# Altium project Arduino_Space.PrjPcb
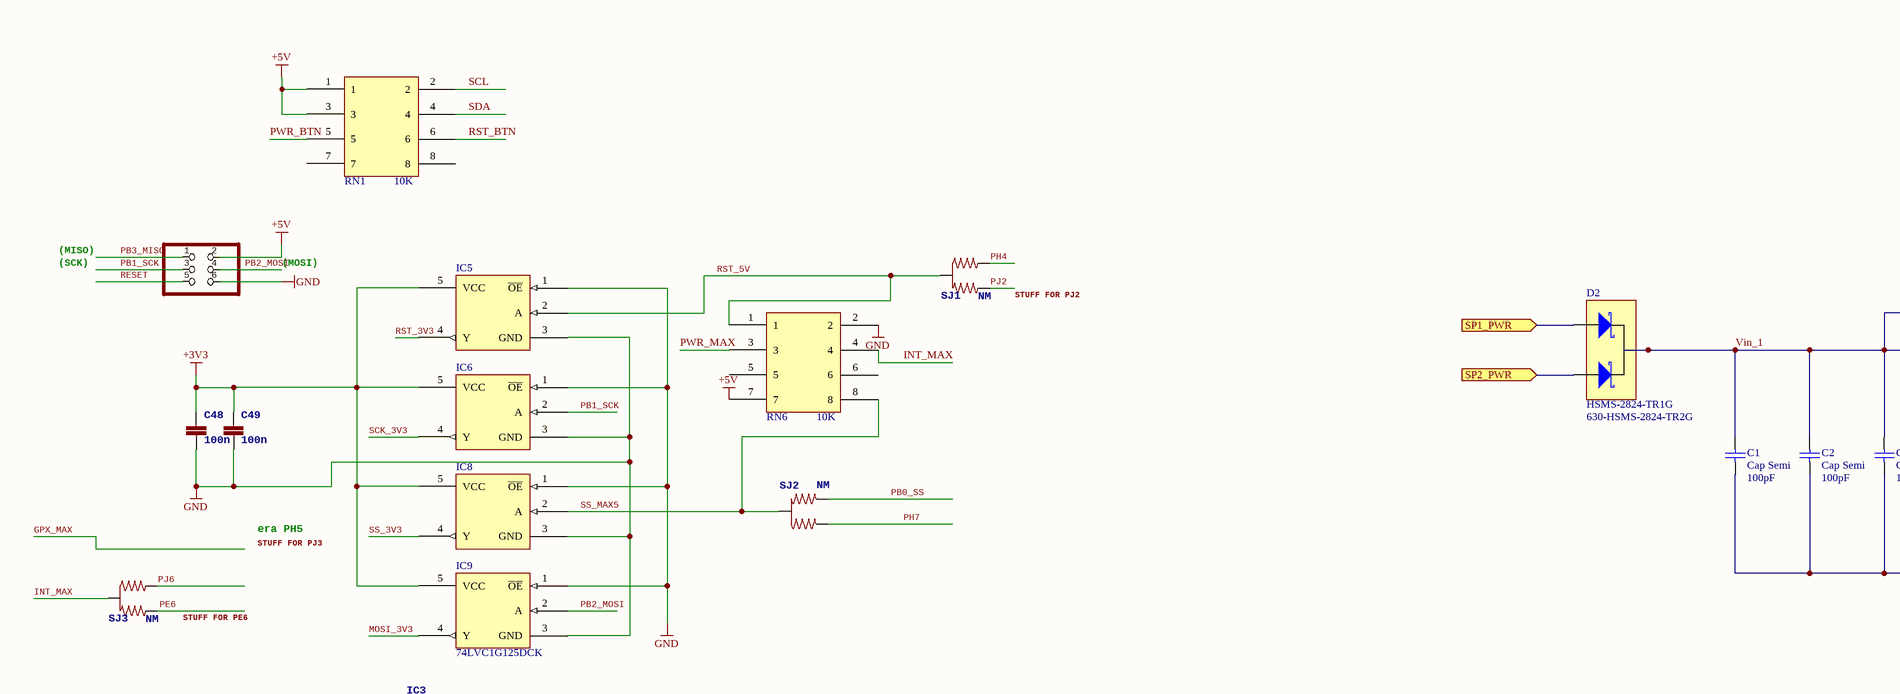
[diagram p0: UPCNSL-ABS-FLS-ARD.SchDoc, top left]
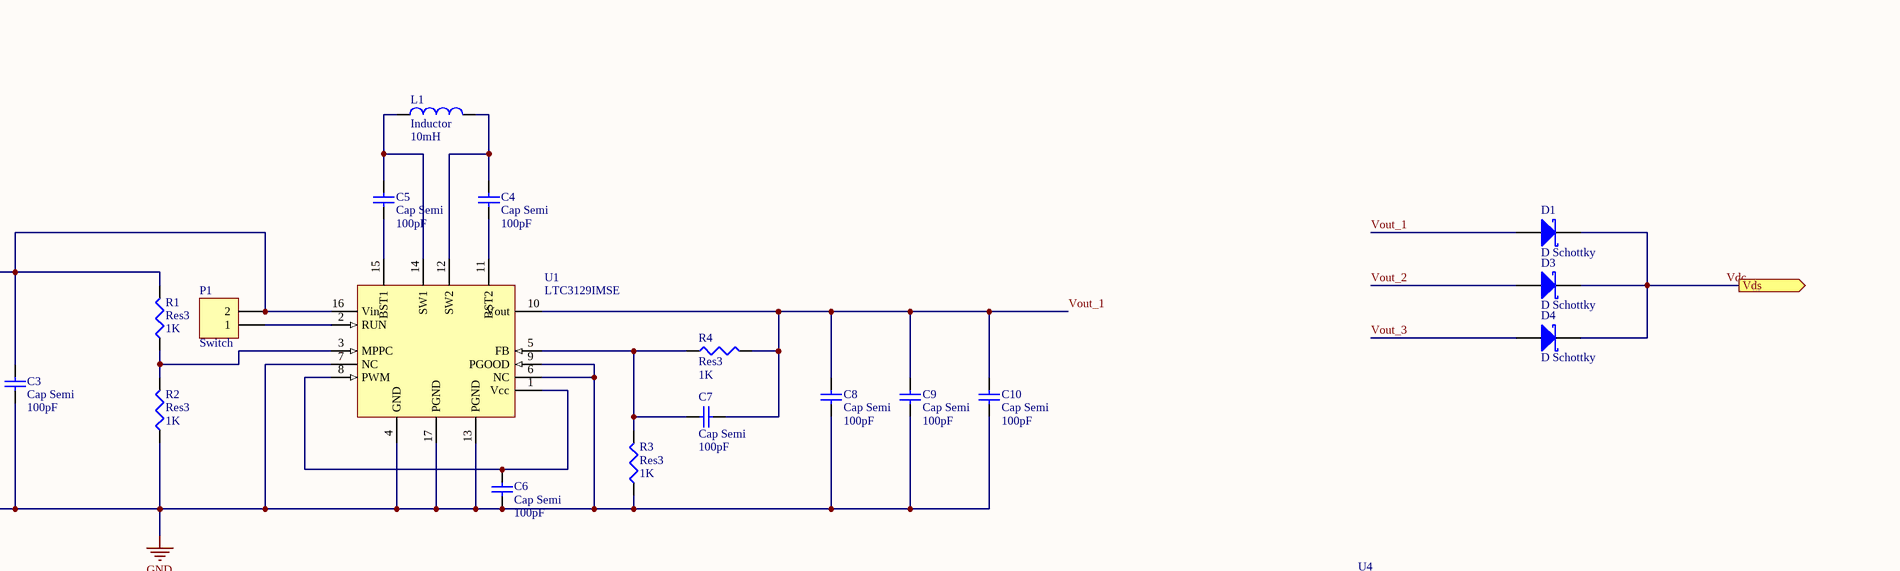
[diagram p1: UPCNSL-ABS-FLS-ARD.SchDoc, top right]
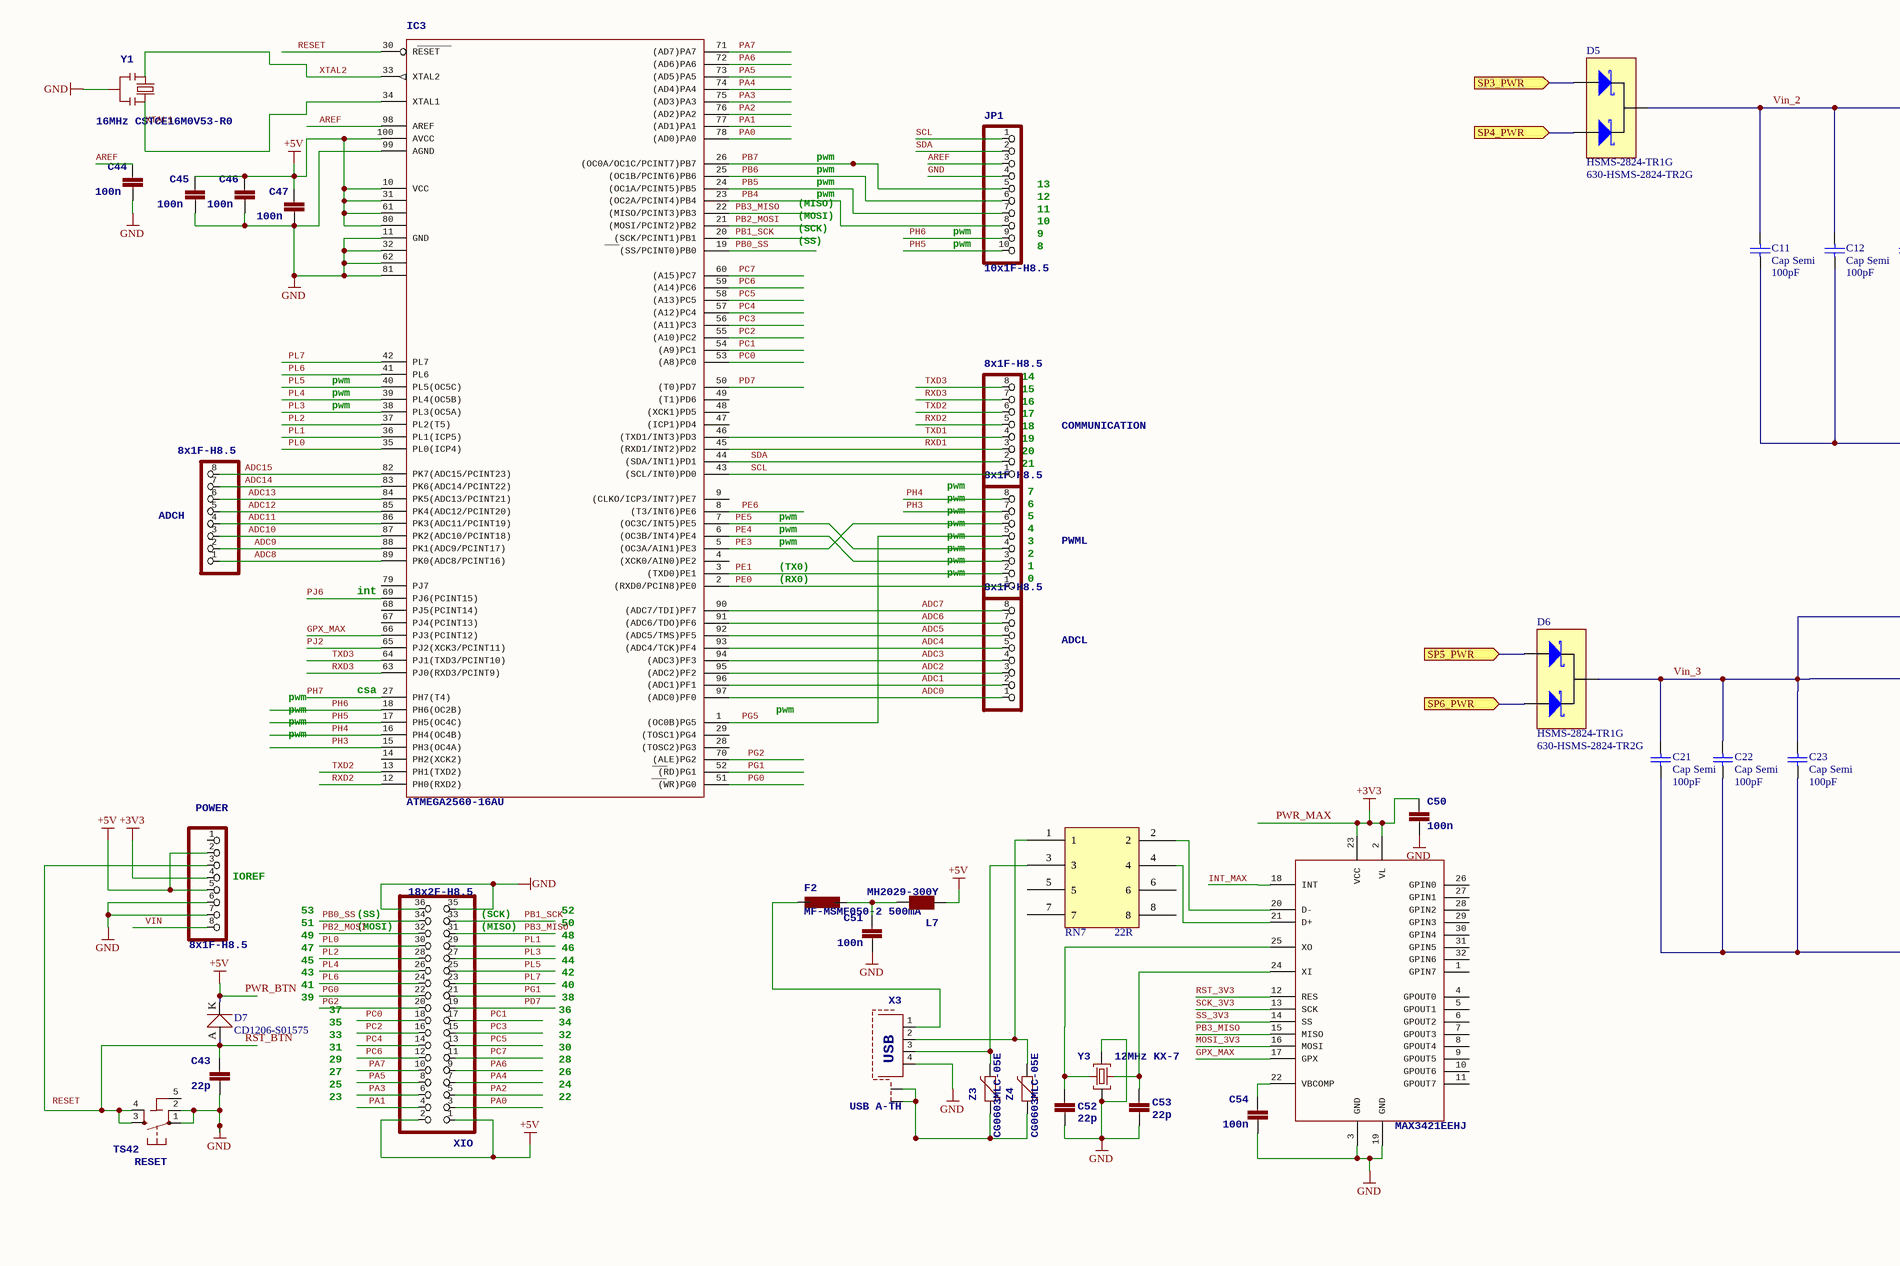
[diagram p2: UPCNSL-ABS-FLS-ARD.SchDoc, bottom left]
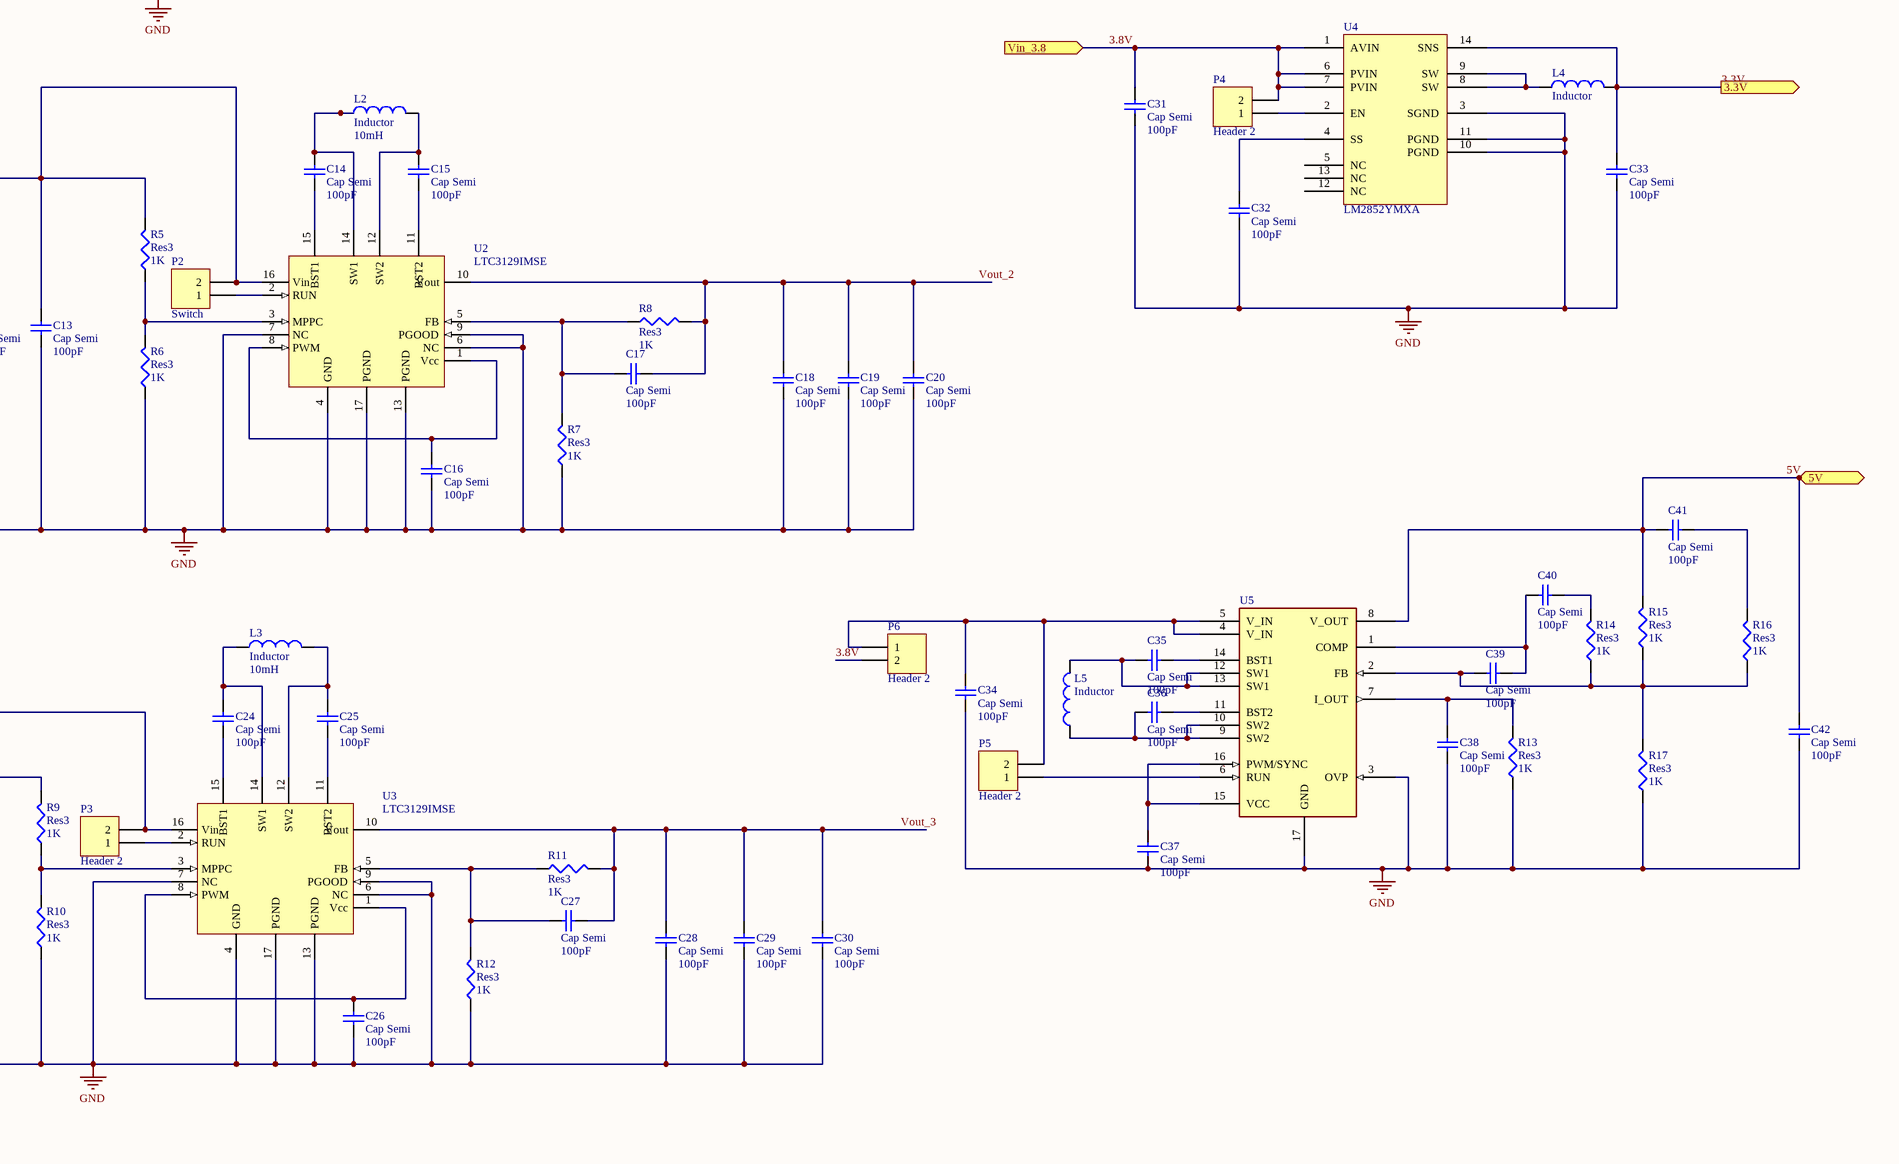
[diagram p3: UPCNSL-ABS-FLS-ARD.SchDoc, bottom right]
1 sheet, 122 parts. Net scope: flat (ports and power ports of the same name join across sheets).
Board file: UPCNSL-ABS-FLS-ARD.PcbDoC

## Sheet UPCNSL-ABS-FLS-ARD.SchDoc
size A1

### Parts
ADCH  8x1F-H8.5  [ADCH]
ADCL  8x1F-H8.5  [ADCL]
C1  Cap Semi  value 100pF  [1608[0603]]
C2  Cap Semi  value 100pF  [1608[0603]]
C3  Cap Semi  value 100pF  [1608[0603]]
C4  Cap Semi  value 100pF  [1608[0603]]
C5  Cap Semi  value 100pF  [1608[0603]]
C6  Cap Semi  value 100pF  [1608[0603]]
C7  Cap Semi  value 100pF  [1608[0603]]
C8  Cap Semi  value 100pF  [1608[0603]]
C9  Cap Semi  value 100pF  [1608[0603]]
C10  Cap Semi  value 100pF  [1608[0603]]
C11  Cap Semi  value 100pF  [1608[0603]]
C12  Cap Semi  value 100pF  [1608[0603]]
C13  Cap Semi  value 100pF  [1608[0603]]
C14  Cap Semi  value 100pF  [1608[0603]]
C15  Cap Semi  value 100pF  [1608[0603]]
C16  Cap Semi  value 100pF  [1608[0603]]
C17  Cap Semi  value 100pF  [1608[0603]]
C18  Cap Semi  value 100pF  [1608[0603]]
C19  Cap Semi  value 100pF  [1608[0603]]
C20  Cap Semi  value 100pF  [1608[0603]]
C21  Cap Semi  value 100pF  [1608[0603]]
C22  Cap Semi  value 100pF  [1608[0603]]
C23  Cap Semi  value 100pF  [1608[0603]]
C24  Cap Semi  value 100pF  [1608[0603]]
C25  Cap Semi  value 100pF  [1608[0603]]
C26  Cap Semi  value 100pF  [1608[0603]]
C27  Cap Semi  value 100pF  [1608[0603]]
C28  Cap Semi  value 100pF  [1608[0603]]
C29  Cap Semi  value 100pF  [1608[0603]]
C30  Cap Semi  value 100pF  [1608[0603]]
C31  Cap Semi  value 100pF  [1608[0603]]
C32  Cap Semi  value 100pF  [1608[0603]]
C33  Cap Semi  value 100pF  [1608[0603]]
C34  Cap Semi  value 100pF  [1608[0603]]
C35  Cap Semi  value 100pF  [1608[0603]]
C36  Cap Semi  value 100pF  [1608[0603]]
C37  Cap Semi  value 100pF  [1608[0603]]
C38  Cap Semi  value 100pF  [1608[0603]]
C39  Cap Semi  value 100pF  [1608[0603]]
C40  Cap Semi  value 100pF  [1608[0603]]
C41  Cap Semi  value 100pF  [1608[0603]]
C42  Cap Semi  value 100pF  [1608[0603]]
C43  >NAME: C43  [CAP0603]  (hidden comment: 22p)
C44  100n  [CAP0603]
C45  100n  [CAP0603]
C46  100n  [CAP0603]
C47  100n  [CAP0603]
C48  >NAME: C48  [CAP0603]  (hidden comment: 100n)
C49  >NAME: C49  [CAP0603]  (hidden comment: 100n)
C50  >NAME: C50  [CAP0603]  (hidden comment: 100n)
C51  >NAME: C51  [CAP0603]  (hidden comment: 100n)
C52  22p  [CAP0603]
C53  22p  [CAP0603]
C54  >NAME: C54  [CAP0603]  (hidden comment: 100n)
COMMUNICATION  8x1F-H8.5  [COMMUNICATION]
D1  D Schottky  [SMB]
D2  HSMS-2824-TR1G  Supplier Part Number 1: 630-HSMS-2824-TR2G  [SOT23-3]
D3  D Schottky  [SMB]
D4  D Schottky  [SMB]
D5  HSMS-2824-TR1G  Supplier Part Number 1: 630-HSMS-2824-TR2G  [SOT23-3]
D6  HSMS-2824-TR1G  Supplier Part Number 1: 630-HSMS-2824-TR2G  [SOT23-3]
D7  CD1206-S01575  [SMD DIODE]
F2  >NAME: F2  [FUSE]  (hidden comment: MF-MSMF050-2 500mA)
IC3  ATMEGA2560-16AU  [TSQFP50P1600X1600X120-100N]
IC5  74LVC1G125DCK  [SOT65P210X110-5N]  (value not drawn)
IC6  74LVC1G125DCK  [SOT65P210X110-5N]  (value not drawn)
IC8  74LVC1G125DCK  [SOT65P210X110-5N]  (value not drawn)
IC9  74LVC1G125DCK  [SOT65P210X110-5N]
ICSP  3x2M  [Header 3x2]  (value not drawn)
JP1  >NAME: JP1  [HEADER 1X10]  (hidden comment: 10x1F-H8.5)
L1  Inductor  value 10mH  [0603]
L2  Inductor  value 10mH  [0603]
L3  Inductor  value 10mH  [0603]
L4  Inductor  [0402-A]
L5  Inductor  [0402-A]
L7  >NAME: L7  [INDUCTOR]  (hidden comment: MH2029-300Y)
P1  Switch  [HDR1X2]
P2  Switch  [HDR1X2]
P3  Header 2  [HDR1X2]
P4  Header 2  [HDR1X2]
P5  Header 2  [HDR1X2]
P6  Header 2  [HDR1X2]
POWER  8x1F-H8.5  [POWER]
PWML  8x1F-H8.5  [PWM]
R1  Res3  value 1K  [J1-0603]
R2  Res3  value 1K  [J1-0603]
R3  Res3  value 1K  [J1-0603]
R4  Res3  value 1K  [J1-0603]
R5  Res3  value 1K  [J1-0603]
R6  Res3  value 1K  [J1-0603]
R7  Res3  value 1K  [J1-0603]
R8  Res3  value 1K  [J1-0603]
R9  Res3  value 1K  [J1-0603]
R10  Res3  value 1K  [J1-0603]
R11  Res3  value 1K  [J1-0603]
R12  Res3  value 1K  [J1-0603]
R13  Res3  value 1K  [J1-0603]
R14  Res3  value 1K  [J1-0603]
R15  Res3  value 1K  [J1-0603]
R16  Res3  value 1K  [J1-0603]
R17  Res3  value 1K  [J1-0603]
RESET  >NAME: RESET  [TS42]  (hidden comment: TS42)
RN1  10K  [CAF-80P319X159-8N]
RN6  10K  [CAF-80P319X159-8N]
RN7  22R  [CAF-80P319X159-8N]
SJ1  NM  [J0402]
SJ2  NM  [J0402]
SJ3  NM  [J0402]
U1  LTC3129IMSE  [MSOP-16]
U2  LTC3129IMSE  [MSOP-16]
U3  LTC3129IMSE  [MSOP-16]
U4  LM2852YMXA  [TSOP65P650X110-14N (LM2852YMXA)]
U5  LTC3112EDHD#PBF  [SON50P400X85_HS-17N]  (value not drawn)
U7A  MAX3421EEHJ  [TSQFP50P700X700X120-32N]
X3  >NAME: X3  [PN87520-S]  (hidden comment: USB A-TH)
XIO  >NAME: XIO  [HEADER 2X18]  (hidden comment: 18x2F-H8.5)
Y1  16MHz CSTCE16M0V53-R0  [RESONATOR]
Y3  12MHz KX-7  [CRYSTAL-3.2-2.5]
Z3  CG0603MLC-05E  [0603]
Z4  CG0603MLC-05E  [0603]

### Ports
3.3V (out), 5V (out), SP1_PWR (in), SP2_PWR (in), SP3_PWR (in), SP4_PWR (in), SP5_PWR (in), SP6_PWR (in), Vds (out), Vin_3.8 (in)

### Nets
GND: C1.1 C2.1 C3.1 C6.1 C8.1 C9.1 C10.1 C11.1 C12.1 C13.1 C16.1 C18.1 C19.1 C20.1 C21.1 C22.1 C23.1 C26.1 C28.1 C29.1 C30.1 C31.1 C32.1 C33.1 C34.1 C37.1 C38.1 C42.1 C43.2 C44.2 C45.2 C46.2 C47.2 C48.2 C49.2 C50.2 C51.2 C52.1 C53.1 C54.2 IC3.11(GND) IC3.32(GND1) IC3.62(GND2) IC3.81(GND3) IC3.99(AGND) IC5.1(~{OE}) IC5.3(GND) IC6.1(~{OE}) IC6.3(GND) IC8.1(~{OE}) IC8.3(GND) IC9.1(~{OE}) IC9.3(GND) ICSP.6 JP1.4 POWER.6 POWER.7 R2.1 R3.1 R6.1 R7.1 R10.1 R12.1 R13.1 R17.1 RESET.1 RESET.2 RN6.2 U1.4(GND) U1.6(NC) U1.7(NC) U1.9(PGOOD) U1.13(PGND) U1.17(PGND) U2.4(GND) U2.6(NC) U2.7(NC) U2.9(PGOOD) U2.13(PGND) U2.17(PGND) U3.4(GND) U3.6(NC) U3.7(NC) U3.9(PGOOD) U3.13(PGND) U3.17(PGND) U4.3(SGND) U4.10(PGND) U4.11(PGND) U5.3(OVP) U5.17(GND) U7A.3(GND) U7A.19(GND) X3.4 XIO.35 XIO.36 Y1.2 Y3.2(GND) Y3.4(GND)
PWR_BTN: C45.1 C46.1 C47.1 D7.K IC3.10(VCC) IC3.31(VCC1) IC3.61(VCC2) IC3.80(VCC3) IC3.100(AVCC) ICSP.2 L7.1 POWER.2 POWER.5 RN1.1 RN1.3 RN1.5 RN6.7 XIO.1 XIO.2  [also labelled +5V]
PWR_MAX: C48.1 C49.1 C50.1 IC5.5(VCC) IC6.5(VCC) IC8.5(VCC) IC9.5(VCC) POWER.4 RN6.3 U7A.2(VL) U7A.23(VCC)  [also labelled +3V3]
3.3V: C33.2 L4.2 U4.14(SNS) ; port 3.3V
3.8V: C31.2 P4.2 P6.2 U4.1(AVIN) U4.6(PVIN) U4.7(PVIN) ; port Vin_3.8
5V: C41.1 C42.2 R15.2 U5.8(V_OUT) ; port 5V
ADC0: ADCL.1 IC3.97((ADC0)PF0)
ADC1: ADCL.2 IC3.96((ADC1)PF1)
ADC2: ADCL.3 IC3.95((ADC2)PF2)
ADC3: ADCL.4 IC3.94((ADC3)PF3)
ADC4: ADCL.5 IC3.93((ADC4/TCK)PF4)
ADC5: ADCL.6 IC3.92((ADC5/TMS)PF5)
ADC6: ADCL.7 IC3.91((ADC6/TDO)PF6)
ADC7: ADCL.8 IC3.90((ADC7/TDI)PF7)
ADC8: ADCH.1 IC3.89(PK0(ADC8/PCINT16))
ADC9: ADCH.2 IC3.88(PK1(ADC9/PCINT17))
ADC10: ADCH.3 IC3.87(PK2(ADC10/PCINT18))
ADC11: ADCH.4 IC3.86(PK3(ADC11/PCINT19))
ADC12: ADCH.5 IC3.85(PK4(ADC12/PCINT20))
ADC13: ADCH.6 IC3.84(PK5(ADC13/PCINT21))
ADC14: ADCH.7 IC3.83(PK6(ADC14/PCINT22))
ADC15: ADCH.8 IC3.82(PK7(ADC15/PCINT23))
AREF: C44.1 IC3.98(AREF) JP1.3
GPX_MAX: IC3.66(PJ3(PCINT12)) U7A.17(GPX)
INT_MAX: RN6.4 SJ3.2(C) U7A.18(INT)
MOSI_3V3: IC9.4(Y) U7A.16(MOSI)
PA0: IC3.78((AD0)PA0) XIO.3
PA1: IC3.77((AD1)PA1) XIO.4
PA2: IC3.76((AD2)PA2) XIO.5
PA3: IC3.75((AD3)PA3) XIO.6
PA4: IC3.74((AD4)PA4) XIO.7
PA5: IC3.73((AD5)PA5) XIO.8
PA6: IC3.72((AD6)PA6) XIO.9
PA7: IC3.71((AD7)PA7) XIO.10
PB0_SS: IC3.19((SS/PCINT0)PB0) SJ2.3 XIO.34
PB1_SCK: IC3.20((SCK/PCINT1)PB1) IC6.2(A) ICSP.3 XIO.33
PB2_MOSI: IC3.21((MOSI/PCINT2)PB2) IC9.2(A) ICSP.4 XIO.32
PB3_MISO: IC3.22((MISO/PCINT3)PB3) ICSP.1 U7A.15(MISO) XIO.31
PB4: IC3.23((OC2A/PCINT4)PB4) JP1.8
PB5: IC3.24((OC1A/PCINT5)PB5) JP1.7
PB6: IC3.25((OC1B/PCINT6)PB6) JP1.6
PB7: IC3.26((OC0A/OC1C/PCINT7)PB7) JP1.5
PC0: IC3.53((A8)PC0) XIO.18
PC1: IC3.54((A9)PC1) XIO.17
PC2: IC3.55((A10)PC2) XIO.16
PC3: IC3.56((A11)PC3) XIO.15
PC4: IC3.57((A12)PC4) XIO.14
PC5: IC3.58((A13)PC5) XIO.13
PC6: IC3.59((A14)PC6) XIO.12
PC7: IC3.60((A15)PC7) XIO.11
PD7: IC3.50((T0)PD7) XIO.19
PE0: IC3.2((RXD0/PCIN8)PE0) PWML.1
PE1: IC3.3((TXD0)PE1) PWML.2
PE3: IC3.5((OC3A/AIN1)PE3) PWML.6
PE4: IC3.6((OC3B/INT4)PE4) PWML.3
PE5: IC3.7((OC3C/INT5)PE5) PWML.4
PE6: IC3.8((T3/INT6)PE6) SJ3.3
PG0: IC3.51((WR)PG0) XIO.22
PG1: IC3.52((RD)PG1) XIO.21
PG2: IC3.70((ALE)PG2) XIO.20
PG5: IC3.1((OC0B)PG5) PWML.5
PH3: IC3.15(PH3(OC4A)) PWML.7
PH4: IC3.16(PH4(OC4B)) PWML.8 SJ1.1
PH5: IC3.17(PH5(OC4C)) JP1.10
PH6: IC3.18(PH6(OC2B)) JP1.9
PH7: IC3.27(PH7(T4)) SJ2.1
PJ2: IC3.65(PJ2(XCK3/PCINT11)) SJ1.3
PJ6: IC3.69(PJ6(PCINT15)) SJ3.1
PL0: IC3.35(PL0(ICP4)) XIO.30
PL1: IC3.36(PL1(ICP5)) XIO.29
PL2: IC3.37(PL2(T5)) XIO.28
PL3: IC3.38(PL3(OC5A)) XIO.27
PL4: IC3.39(PL4(OC5B)) XIO.26
PL5: IC3.40(PL5(OC5C)) XIO.25
PL6: IC3.41(PL6) XIO.24
PL7: IC3.42(PL7) XIO.23
RESET: IC3.30(RESET) ICSP.5
RST_3V3: IC5.4(Y) U7A.12(RES)
RST_5V: IC5.2(A) RN6.1 SJ1.2(C)
RST_BTN: C43.1 D7.A POWER.3 RESET.3 RESET.4 RN1.6
RXD1: COMMUNICATION.3 IC3.45((RXD1/INT2)PD2)
RXD2: COMMUNICATION.5 IC3.12(PH0(RXD2))
RXD3: COMMUNICATION.7 IC3.63(PJ0(RXD3/PCINT9))
SCK_3V3: IC6.4(Y) U7A.13(SCK)
SCL: COMMUNICATION.1 IC3.43((SCL/INT0)PD0) JP1.1 RN1.2
SDA: COMMUNICATION.2 IC3.44((SDA/INT1)PD1) JP1.2 RN1.4
SS_3V3: IC8.4(Y) U7A.14(SS)
SS_MAX5: IC8.2(A) RN6.8 SJ2.2(C)
TXD1: COMMUNICATION.4 IC3.46((TXD1/INT3)PD3)
TXD2: COMMUNICATION.6 IC3.13(PH1(TXD2))
TXD3: COMMUNICATION.8 IC3.64(PJ1(TXD3/PCINT10))
Vdc: D1.2(K) D3.2(K) D4.2(K) ; port Vds
VIN: POWER.8
Vin_1: C1.2 C2.2 C3.2 D2.3(K) P1.2 R1.2 U1.16(Vin)
Vin_2: C11.2 C12.2 C13.2 D5.3(K) P2.2 R5.2 U2.16(Vin)
Vin_3: C21.2 C22.2 C23.2 D6.3(K) P3.2 R9.2 U3.16(Vin)
Vout_1: C7.2 C8.2 C9.2 C10.2 D1.1(A) R4.2 U1.10(Vout)
Vout_2: C17.2 C18.2 C19.2 C20.2 D3.1(A) R8.2 U2.10(Vout)
Vout_3: C27.1 C28.2 C29.2 C30.2 D4.1(A) R11.2 U3.10(Vout)
XTAL1: IC3.34(XTAL1) Y1.3
XTAL2: IC3.33(XTAL2) Y1.1
NetC4_1: C4.1 U1.11(BST2)
NetC4_2: C4.2 L1.2 U1.12(SW2)
NetC5_1: C5.1 U1.15(BST1)
NetC5_2: C5.2 L1.1 U1.14(SW1)
NetC6_2: C6.2 U1.1(Vcc) U1.8(PWM)
NetC7_1: C7.1 R3.2 R4.1 U1.5(FB)
NetC14_1: C14.1 U2.15(BST1)
NetC14_2: C14.2 L2.1 U2.14(SW1)
NetC15_1: C15.1 U2.11(BST2)
NetC15_2: C15.2 L2.2 U2.12(SW2)
NetC16_2: C16.2 U2.1(Vcc) U2.8(PWM)
NetC17_1: C17.1 R7.2 R8.1 U2.5(FB)
NetC24_1: C24.1 U3.15(BST1)
NetC24_2: C24.2 L3.1 U3.14(SW1)
NetC25_1: C25.1 U3.11(BST2)
NetC25_2: C25.2 L3.2 U3.12(SW2)
NetC26_2: C26.2 U3.1(Vcc) U3.8(PWM)
NetC27_2: C27.2 R11.1 R12.2 U3.5(FB)
NetC32_2: C32.2 U4.4(SS)
NetC34_2: C34.2 P5.2 P6.1 U5.4(V_IN) U5.5(V_IN)
NetC35_1: C35.1 L5.2 U5.12(SW1) U5.13(SW1)
NetC35_2: C35.2 U5.14(BST1)
NetC36_1: C36.1 L5.1 U5.9(SW2) U5.10(SW2)
NetC36_2: C36.2 U5.11(BST2)
NetC37_2: C37.2 U5.15(VCC) U5.16(PWM/SYNC)
NetC38_2: C38.2 R13.2 U5.7(I_OUT)
NetC39_1: C39.1 R14.1 R15.1 R16.1 R17.2 U5.2(FB)
NetC39_2: C39.2 C40.1 U5.1(COMP)
NetC40_2: C40.2 R14.2
NetC41_2: C41.2 R16.2
NetC51_1: C51.1 F2.1 L7.2
NetC52_2: C52.2 U7A.25(XO) Y3.3(C2)
NetC53_2: C53.2 U7A.24(XI) Y3.1(C1)
NetC54_1: C54.1 U7A.22(VBCOMP)
NetD2_1: D2.1(A1) ; port SP1_PWR
NetD2_2: D2.2(A2) ; port SP2_PWR
NetD5_1: D5.1(A1) ; port SP3_PWR
NetD5_2: D5.2(A2) ; port SP4_PWR
NetD6_1: D6.1(A1) ; port SP5_PWR
NetD6_2: D6.2(A2) ; port SP6_PWR
NetF2_2: F2.2 X3.1
NetL4_1: L4.1 U4.8(SW) U4.9(SW)
NetP1_1: P1.1 U1.2(RUN)
NetP2_1: P2.1 U2.2(RUN)
NetP3_1: P3.1 U3.2(RUN)
NetP4_1: P4.1 U4.2(EN)
NetP5_1: P5.1 U5.6(RUN)
NetR1_1: R1.1 R2.2 U1.3(MPPC)
NetR5_1: R5.1 R6.2 U2.3(MPPC)
NetR9_1: R9.1 R10.2 U3.3(MPPC)
NetRN7_1: RN7.1 X3.2 Z4.2
NetRN7_2: RN7.2 U7A.20(D-)
NetRN7_3: RN7.3 X3.3 Z3.2
NetRN7_4: RN7.4 U7A.21(D+)
NetX3_S1: X3.S1 X3.S2 Z3.1 Z4.1

Not connected (* = marked no-connect by the designer): IC3 4((XCK0/AIN0)PE2) 9((CLKO/ICP3/INT7)PE7) 14(PH2(XCK2)) 28((TOSC2)PG3) 29((TOSC1)PG4) 47((ICP1)PD4) 48((XCK1)PD5) 49((T1)PD6) 67(PJ4(PCINT13)) 68(PJ5(PCINT14)) 79(PJ7); POWER 1; RESET 5(5-GND); RN1 7 8; RN6 5 6; RN7 5 6 7 8; U4 5(NC) 12(NC) 13(NC); U7A 1(GPIN7) 4(GPOUT0) 5(GPOUT1) 6(GPOUT2) 7(GPOUT3) 8(GPOUT4) 9(GPOUT5) 10(GPOUT6) 11(GPOUT7) 26(GPIN0) 27(GPIN1) 28(GPIN2) 29(GPIN3) 30(GPIN4) 31(GPIN5) 32(GPIN6)

### Notes on the sheet
- (SCK)
- (MISO)
- (MOSI)
- (near SJ1) STUFF FOR PJ2
- era PH5
- STUFF FOR PJ3
- (near SJ3) STUFF FOR PE6
- pwm
- (SS)
- (near JP1) pwm
- (near JP1) 9
- (near JP1) 10
- (near JP1) 11
- (near JP1) 12
- (near JP1) 13
- (near JP1) 8
- (near COMMUNICATION) 15
- (near COMMUNICATION) 16
- (near COMMUNICATION) 17
- (near COMMUNICATION) 18
- (near COMMUNICATION) 14
- (near COMMUNICATION) 19
- (near COMMUNICATION) 20
- (near COMMUNICATION) 21
- (near PWML) 2
- (near PWML) 3
- (near PWML) 4
- (near PWML) 5
- (near PWML) 6
- 7
- (near IC3) int
- (TX0)
- (RX0)
- (near PWML) 0
- (near PWML) 1
- (near IC3) csa
- (near POWER) IOREF
- 51
- 53
- (near XIO) (MOSI)
- (near XIO) (SCK)
- (near XIO) (MISO)
- 52
- 50
- 49
- 47
- 45
- 43
- 41
- 48
- 46
- 44
- 42
- 40
- 39
- 31
- 33
- 35
- 37
- 30
- 32
- 34
- 36
- 38
- 23
- 25
- 27
- 29
- 22
- 24
- 26
- 28
- Labels drawn without touching a wire or pin: RESET

### Library data of the parts
ADCH ADCL COMMUNICATION POWER PWML = PINHD-1X8: <b>PIN HEADER</b>
C1-C42 = Cap Semi: Capacitor (Semiconductor SIM Model); Published: 8-Jun-2000; LatestRevisionDate: 29-May-2009; LatestRevisionNote: IPC-7351 Footprint Added.; PackageReference: C1206; Publisher: Altium Limited; PackageDescription: Chip Capacitor
C43-C54 = C-EU0603-RND: <B>CAPACITOR</B>, European symbol
  C43: >VALUE: 22p
  C48-C51 C54: >VALUE: 100n
D1 D3 D4 = D Schottky: Schottky Diode; Published: 8-Jun-2000; LatestRevisionDate: 17-Jul-2002; LatestRevisionNote: Re-released for DXP Platform.; PackageReference: SMB; Publisher: Altium Limited; PackageDescription: DO-214-AA/SMB; 2 C-Bend Leads; Body 5.3 x 3.6 mm, inc. leads (LxW); Code_JEDEC: DO-214-AA
D2 D5 D6 = HSMS-2824-TR1G: DIODE, RF, SCHOTTKY, DUAL, SOT-23; Supplier 1: Mouser
D7 = DIODE
F2 = L-EUL1812: <B>INDUCTOR</B>, European symbol; >VALUE: MF-MSMF050-2 500mA
IC3 = ATMEGA2560AU: <b>MICROCONTROLLER</b><p> / 64/128/256 Kbytes FLASH<p> / 4 Kbytes EEPROM<p> / 8 Kbytes SRAM<p> / 86 General Purpose I/O pins<p> / 12-channels16-bit PWM<p> / 4 x Serial USARTs<p> / 16-channels 10-bit A/D<p>
ICSP = PINHD-2X3: <b>PIN HEADER</b>; >NAME: ICSP; >VALUE: 3x2M
JP1 = PINHD-1X10: <b>PIN HEADER</b>; >VALUE: 10x1F-H8.5
L1-L3 = Inductor: Code_IEC: 1005; Published: 8-Jun-2000; LatestRevisionDate: 29-May-2009; LatestRevisionNote: IPC-7351 Footprint Added.; PackageReference: 0402-A; Publisher: Altium Limited; PackageDescription: Chip Inductor; Code_JEITA: 0402
L4 L5 = Inductor: Code_IEC: 1005; Value: 10mH; Published: 8-Jun-2000; LatestRevisionDate: 29-May-2009; LatestRevisionNote: IPC-7351 Footprint Added.; PackageReference: 0402-A; Publisher: Altium Limited; PackageDescription: Chip Inductor; Code_JEITA: 0402
L7 = WE-CBF_0805: SMD EMI Suppression Ferrite Beads / - excellent anti-EMI properties / - low DCR / - impedances till 3000 ohms / - rated current up to 6 A; >VALUE: MH2029-300Y
P1-P6 = Header 2: Header, 2-Pin; LatestRevisionDate: 17-Jul-2002; LatestRevisionNote: Re-released for DXP Platform.; Publisher: Altium Limited
R1-R17 = Res3: Resistor; Published: 8-Jun-2000; LatestRevisionDate: 29-May-2009; LatestRevisionNote: IPC-7351 Footprint Added.; PackageReference: J1-0603; Publisher: Altium Limited; PackageDescription: Chip Resistor
RESET = TS42: TS42 / Dongnan Electronics / Tact switch / VDC 12V - 50mA; >VALUE: TS42
RN1 RN6 RN7 = RES_ARRAY
SJ1-SJ3 = J0402: Three terminal jumper made from two 0402, 0603, 0805, etc.
U1-U3 = LTC3129: 15V, 200mA Synchronous Buck-Boost DC/DC Converter with 1.3µA Quiescent Current; Supplier 1: Digi-Key; Supplier Part Number 1: LTC3129IMSE#PBF-ND
U5 = LTC3112EDHD#PBF: IC REG BUCK BOOST ADJ 2.5A 16DFN; Supplier 1: Digi-Key
U7A = MAX3421EEHJ: MAX3421 SPI to USB Interface Chip
X3 = PN87520-S: >VALUE: USB A-TH; USB: USB
XIO = PINHD-2X18: <b>PIN HEADER</b>; >VALUE: 18x2F-H8.5
Y1 = RESONATORMU
Y3 = CRYSTAL-3.2-2.5
Z3 Z4 = VARISTORCN0603: <b>VARISTOR</b>
IC5 IC6 IC8 IC9 = 74LVC1G125DCK: Supplier 1: Mouser; Supplier Part Number 1: 595-SN74LVC1G125DCKT